# Altium schematic sheet SP3232EEN.SchDoc
size A; SheetNumber: 6; SheetTotal: 7
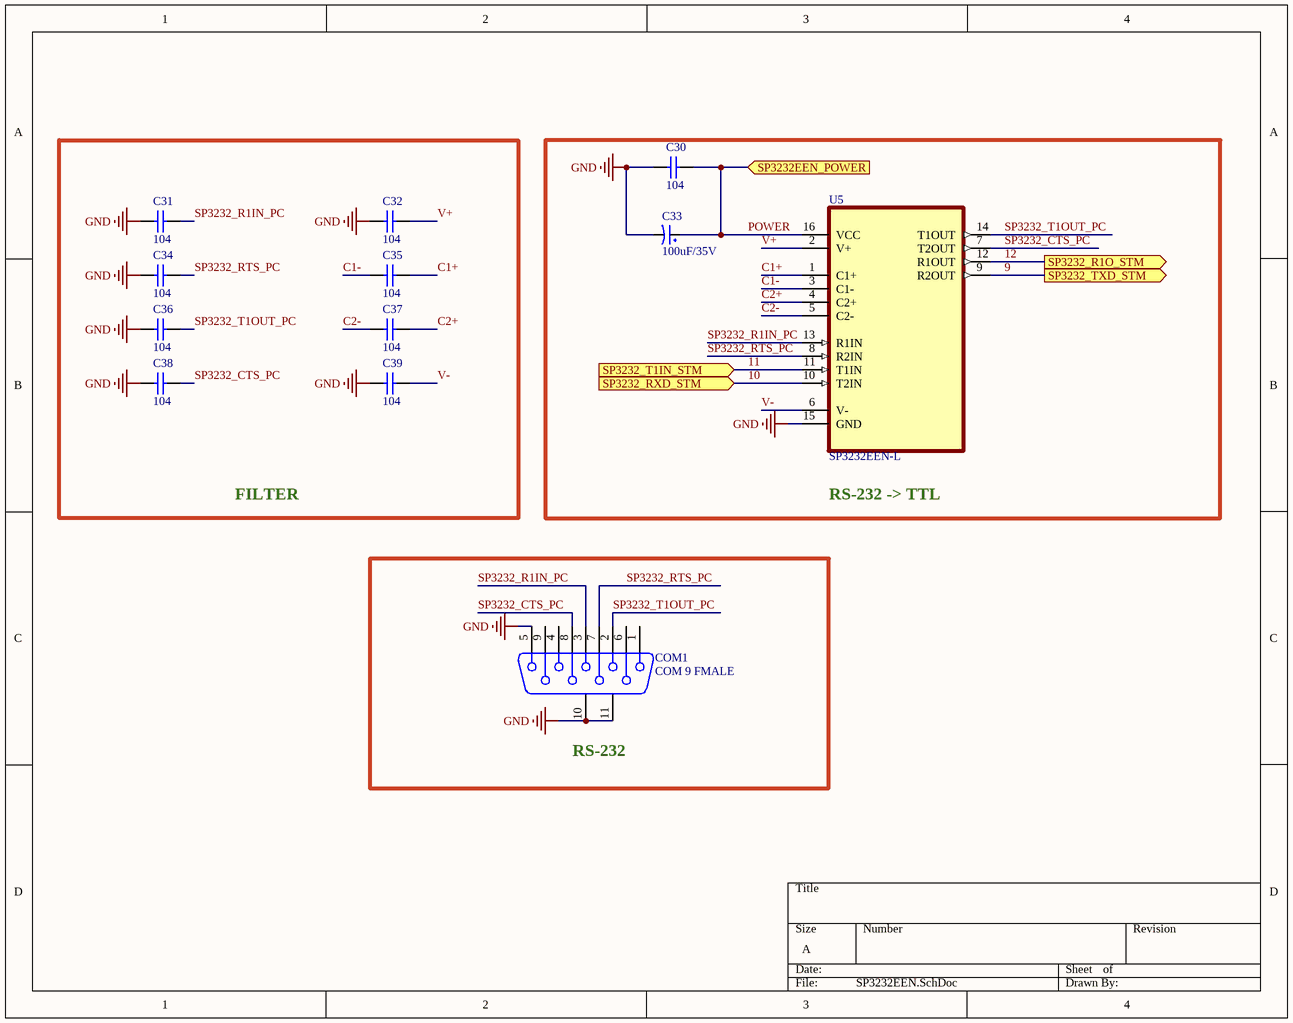
[diagram p0: SP3232EEN.SchDoc]

## Parts
C30  104  [0805]
C31  104  [0805]
C32  104  [0805]
C33  100uF/35V  [CP1.5/3.4]
C34  104  [0805]
C35  104  [0805]
C36  104  [0805]
C37  104  [0805]
C38  104  [0805]
C39  104  [0805]
COM1  COM 9 FMALE  [DSB 9-F]
U5  SP3232EEN-L  [SP3232EEN]

## Blocks framed on the sheet
FILTER: C31 C32 C34-C39
RS-232 -> TTL: C30 C33 U5
RS-232: COM1

## Ports
SP3232_R1O_STM (out), SP3232_RXD_STM (in), SP3232_T1IN_STM (in), SP3232_TXD_STM (out), SP3232EEN_POWER (in)

## Nets
GND: C30.1 C31.1 C32.1 C33.2 C34.1 C36.1 C38.1 C39.1 COM1.5 COM1.10(MH1) COM1.11(MH2) U5.15(GND)
9: U5.9(R2OUT) ; port SP3232_TXD_STM
10: U5.10(T2IN) ; port SP3232_RXD_STM
11: U5.11(T1IN) ; port SP3232_T1IN_STM
12: U5.12(R1OUT) ; port SP3232_R1O_STM
C1+: C35.2 U5.1(C1+)
C1-: C35.1 U5.3(C1-)
C2+: C37.2 U5.4(C2+)
C2-: C37.1 U5.5(C2-)
POWER: C30.2 C33.1 U5.16(VCC) ; port SP3232EEN_POWER
SP3232_CTS_PC: C38.2 COM1.8 U5.7(T2OUT)
SP3232_R1IN_PC: C31.2 COM1.3 U5.13(R1IN)
SP3232_RTS_PC: C34.2 COM1.7 U5.8(R2IN)
SP3232_T1OUT_PC: C36.2 COM1.2 U5.14(T1OUT)
V+: C32.2 U5.2(V+)
V-: C39.2 U5.6(V-)

Not connected (* = marked no-connect by the designer): COM1 1 4 6 9

## Library data of the parts
C30-C32 C34-C39 = Cap 104_SMD: Capacitor (Semiconductor SIM Model); Value: 0.1uF; Published: 8-Jun-2000; LatestRevisionDate: 17-Jul-2002; LatestRevisionNote: Re-released for DXP Platform.; PackageReference: C1206; Publisher: Altium Limited
C33 = CP3: Cap 100uF/35V - 470uF/16V; Value: 100uF/35V/50V; Description 1: 1000uF/6,3V - 470uF/16V - 330uF - 25V; Description 2: 220uF/35V - 100uF/50V - 63V - 4,7uF/200V; Description 3: 22uF => 33uF100V - 3,3uF => 4,7uF/250V; Description 4: 2,2uF =>3,3uF/350 - 2,2uF/400V - 1uF/450V
COM1 = DSB9F: COM 9; PackageDocument: O; Positions: 9; Gender: Receptacle; Value: COM 9; Published: 15-Jun-2001; LatestRevisionDate: 17-Jul-2002; LatestRevisionNote: Re-released for DXP Platform.; DatasheetDocument: 1-Sep-1999; PackageReference: 788750; Publisher: Altium Limited; Orientation: Right Angle
U5 = SP3232EEN-L: 2/2 Transceiver Full RS232 16-SOIC; MF: MaxLinear, Inc.; SnapEDA_Link: https://www.snapeda.com/parts/SP3232EEN-L/MaxLinear,%20Inc./view-part/681175/?ref=snap; Check_prices: https://www.snapeda.com/parts/SP3232EEN-L/MaxLinear,%20Inc./view-part/681175/?ref=eda; MP: SP3232EEN-L; Availability: Warning; Price: None; Value: *; Package: SOIC-16 Exar; Purchase-URL: https://pricing.snapeda.com/search/part/SP3232EEN-L/?ref=eda